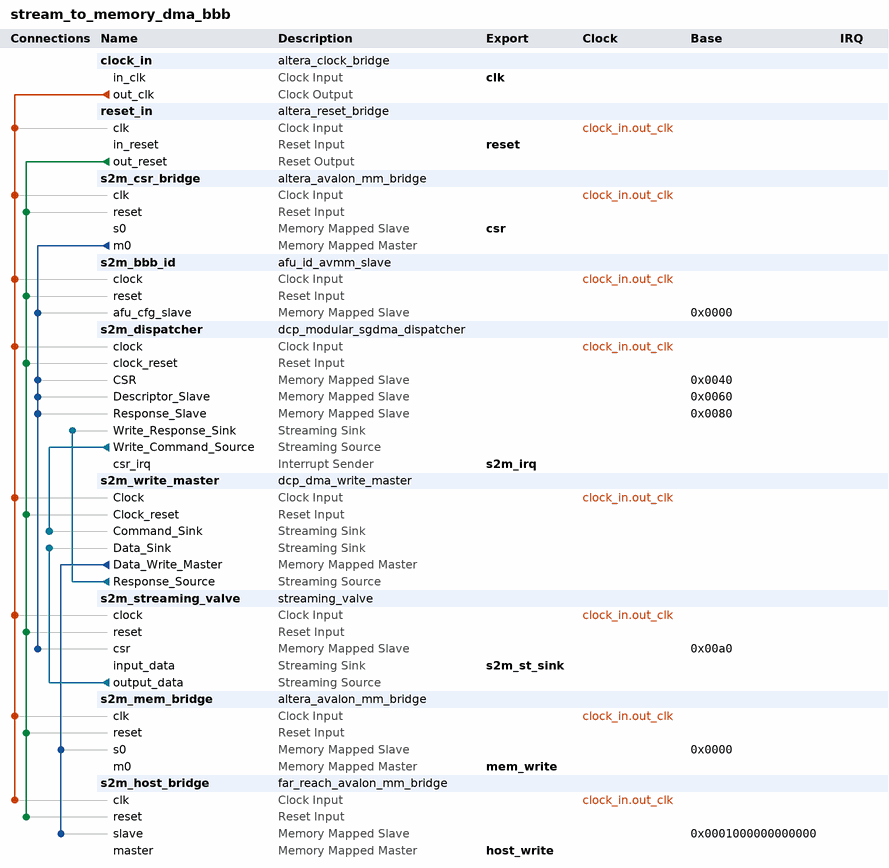
[diagram p0: system contents]
# Platform Designer (Qsys) system stream_to_memory_dma_bbb, Arria 10 10AX115N2F40E2LG
# Parameters at their usual value, and those the tool derives, are not listed.
package require -exact qsys 1.0
create_system stream_to_memory_dma_bbb
set_project_property DEVICE_FAMILY {Arria 10}
set_project_property DEVICE 10AX115N2F40E2LG

add_component clock_in ip/stream_to_memory_dma_bbb/stream_to_memory_dma_bbb_clock_in.ip altera_clock_bridge clock_in 17.1
load_component clock_in
set_component_parameter_value DERIVED_CLOCK_RATE 200000000
set_component_parameter_value EXPLICIT_CLOCK_RATE 200000000
save_component

add_component reset_in ip/stream_to_memory_dma_bbb/stream_to_memory_dma_bbb_reset_in.ip altera_reset_bridge reset_in 17.1
load_component reset_in
set_component_parameter_value ACTIVE_LOW_RESET 0
set_component_parameter_value SYNCHRONOUS_EDGES both
save_component

add_component s2m_csr_bridge ip/stream_to_memory_dma_bbb/stream_to_memory_dma_bbb_csr_bridge.ip altera_avalon_mm_bridge s2m_csr_bridge 17.1

add_component s2m_bbb_id ip/stream_to_memory_dma_bbb/stream_to_memory_dma_bbb_id.ip afu_id_avmm_slave s2m_bbb_id 1.0

add_component s2m_dispatcher ip/stream_to_memory_dma_bbb/stream_to_memory_dma_bbb_dcp_modular_sgdma_dispatcher.ip dcp_modular_sgdma_dispatcher s2m_dispatcher 17.0
load_component s2m_dispatcher
set_component_parameter_value PREFETCHER_USE_CASE 0
set_component_parameter_value MODE 2
set_component_parameter_value GUI_RESPONSE_PORT 0
set_component_parameter_value RESPONSE_PORT 0
set_component_parameter_value DESCRIPTOR_INTERFACE 0
set_component_parameter_value DESCRIPTOR_FIFO_DEPTH 32
set_component_parameter_value ENHANCED_FEATURES 1
set_component_parameter_value DESCRIPTOR_WIDTH 256
set_component_parameter_value DESCRIPTOR_BYTEENABLE_WIDTH 32
set_component_parameter_value CSR_ADDRESS_WIDTH 3
set_component_parameter_value DATA_WIDTH 32
set_component_parameter_value DATA_WIDTH_DERIVED 2
set_component_parameter_value DATA_FIFO_DEPTH 32
set_component_parameter_value DATA_FIFO_DEPTH_DERIVED 1
set_component_parameter_value MAX_BYTE 1024
set_component_parameter_value MAX_BYTE_DERIVED 0
set_component_parameter_value TRANSFER_TYPE {Aligned Accesses}
set_component_parameter_value TRANSFER_TYPE_DERIVED 1
set_component_parameter_value BURST_ENABLE 0
set_component_parameter_value MAX_BURST_COUNT 2
set_component_parameter_value MAX_BURST_COUNT_DERIVED 0
set_component_parameter_value BURST_WRAPPING_SUPPORT 0
set_component_parameter_value STRIDE_ENABLE 0
set_component_parameter_value STRIDE_ENABLE_DERIVED 0
set_component_parameter_value MAX_STRIDE 1
set_component_parameter_value MAX_STRIDE_DERIVED 0
set_component_parameter_value PROGRAMMABLE_BURST_ENABLE 0
set_component_parameter_value CHANNEL_ENABLE 0
set_component_parameter_value CHANNEL_WIDTH 8
set_component_parameter_value CHANNEL_WIDTH_DERIVED 7
set_component_parameter_value ERROR_ENABLE 0
set_component_parameter_value ERROR_WIDTH 8
set_component_parameter_value ERROR_WIDTH_DERIVED 7
set_component_parameter_value PACKET_ENABLE 0
set_component_parameter_value DESCRIPTOR_FIFO_DEPTH_DERIVED 2
save_component

add_component s2m_write_master ip/stream_to_memory_dma_bbb/stream_to_memory_dma_bbb_write_master.ip dcp_dma_write_master s2m_write_master 17.0

add_component s2m_streaming_valve ip/stream_to_memory_dma_bbb/stream_to_memory_dma_bbb_streaming_valve.ip streaming_valve s2m_streaming_valve 1.0
load_component s2m_streaming_valve
set_component_parameter_value DATA_WIDTH 512
set_component_parameter_value EMPTY_WIDTH 6
save_component

add_component s2m_mem_bridge ip/stream_to_memory_dma_bbb/stream_to_memory_dma_bbb_memory_bridge.ip altera_avalon_mm_bridge s2m_mem_bridge 17.1

add_component s2m_host_bridge ip/stream_to_memory_dma_bbb/stream_to_memory_dma_bbb_host_bridge.ip far_reach_avalon_mm_bridge s2m_host_bridge 1.0

# connections
add_connection clock_in.out_clk reset_in.clk clock
add_connection clock_in.out_clk s2m_bbb_id.clock clock
add_connection clock_in.out_clk s2m_csr_bridge.clk clock
add_connection clock_in.out_clk s2m_dispatcher.clock clock
add_connection clock_in.out_clk s2m_host_bridge.clk clock
add_connection clock_in.out_clk s2m_mem_bridge.clk clock
add_connection clock_in.out_clk s2m_streaming_valve.clock clock
add_connection clock_in.out_clk s2m_write_master.Clock clock
add_connection reset_in.out_reset s2m_bbb_id.reset reset
add_connection reset_in.out_reset s2m_csr_bridge.reset reset
add_connection reset_in.out_reset s2m_dispatcher.clock_reset reset
add_connection reset_in.out_reset s2m_host_bridge.reset reset
add_connection reset_in.out_reset s2m_mem_bridge.reset reset
add_connection reset_in.out_reset s2m_streaming_valve.reset reset
add_connection reset_in.out_reset s2m_write_master.Clock_reset reset
add_connection s2m_csr_bridge.m0 s2m_bbb_id.afu_cfg_slave avalon
set_connection_parameter_value s2m_csr_bridge.m0/s2m_bbb_id.afu_cfg_slave baseAddress 0x0000
add_connection s2m_csr_bridge.m0 s2m_dispatcher.CSR avalon
set_connection_parameter_value s2m_csr_bridge.m0/s2m_dispatcher.CSR baseAddress 0x0040
add_connection s2m_csr_bridge.m0 s2m_dispatcher.Descriptor_Slave avalon
set_connection_parameter_value s2m_csr_bridge.m0/s2m_dispatcher.Descriptor_Slave baseAddress 0x0060
add_connection s2m_csr_bridge.m0 s2m_dispatcher.Response_Slave avalon
set_connection_parameter_value s2m_csr_bridge.m0/s2m_dispatcher.Response_Slave baseAddress 0x0080
add_connection s2m_csr_bridge.m0 s2m_streaming_valve.csr avalon
set_connection_parameter_value s2m_csr_bridge.m0/s2m_streaming_valve.csr baseAddress 0x00a0
add_connection s2m_write_master.Data_Write_Master s2m_host_bridge.slave avalon
set_connection_parameter_value s2m_write_master.Data_Write_Master/s2m_host_bridge.slave baseAddress 0x0001000000000000
add_connection s2m_write_master.Data_Write_Master s2m_mem_bridge.s0 avalon
set_connection_parameter_value s2m_write_master.Data_Write_Master/s2m_mem_bridge.s0 baseAddress 0x0000
add_connection s2m_dispatcher.Write_Command_Source s2m_write_master.Command_Sink avalon_streaming
add_connection s2m_streaming_valve.output_data s2m_write_master.Data_Sink avalon_streaming
add_connection s2m_write_master.Response_Source s2m_dispatcher.Write_Response_Sink avalon_streaming

# exported interfaces
add_interface clk clock sink
set_interface_property clk EXPORT_OF clock_in.in_clk
add_interface csr avalon slave
set_interface_property csr EXPORT_OF s2m_csr_bridge.s0
add_interface host_write avalon master
set_interface_property host_write EXPORT_OF s2m_host_bridge.master
add_interface mem_write avalon master
set_interface_property mem_write EXPORT_OF s2m_mem_bridge.m0
add_interface reset reset sink
set_interface_property reset EXPORT_OF reset_in.in_reset
add_interface s2m_irq interrupt sender
set_interface_property s2m_irq EXPORT_OF s2m_dispatcher.csr_irq
add_interface s2m_st_sink avalon_streaming sink
set_interface_property s2m_st_sink EXPORT_OF s2m_streaming_valve.input_data

set_interconnect_requirement {$system} qsys_mm.clockCrossingAdapter HANDSHAKE
set_interconnect_requirement {$system} qsys_mm.enableEccProtection FALSE
set_interconnect_requirement {$system} qsys_mm.insertDefaultSlave FALSE
set_interconnect_requirement {$system} qsys_mm.maxAdditionalLatency 1

save_system stream_to_memory_dma_bbb.qsys
